# EAGLE design zik-pcb-power (EAGLE 6.4)
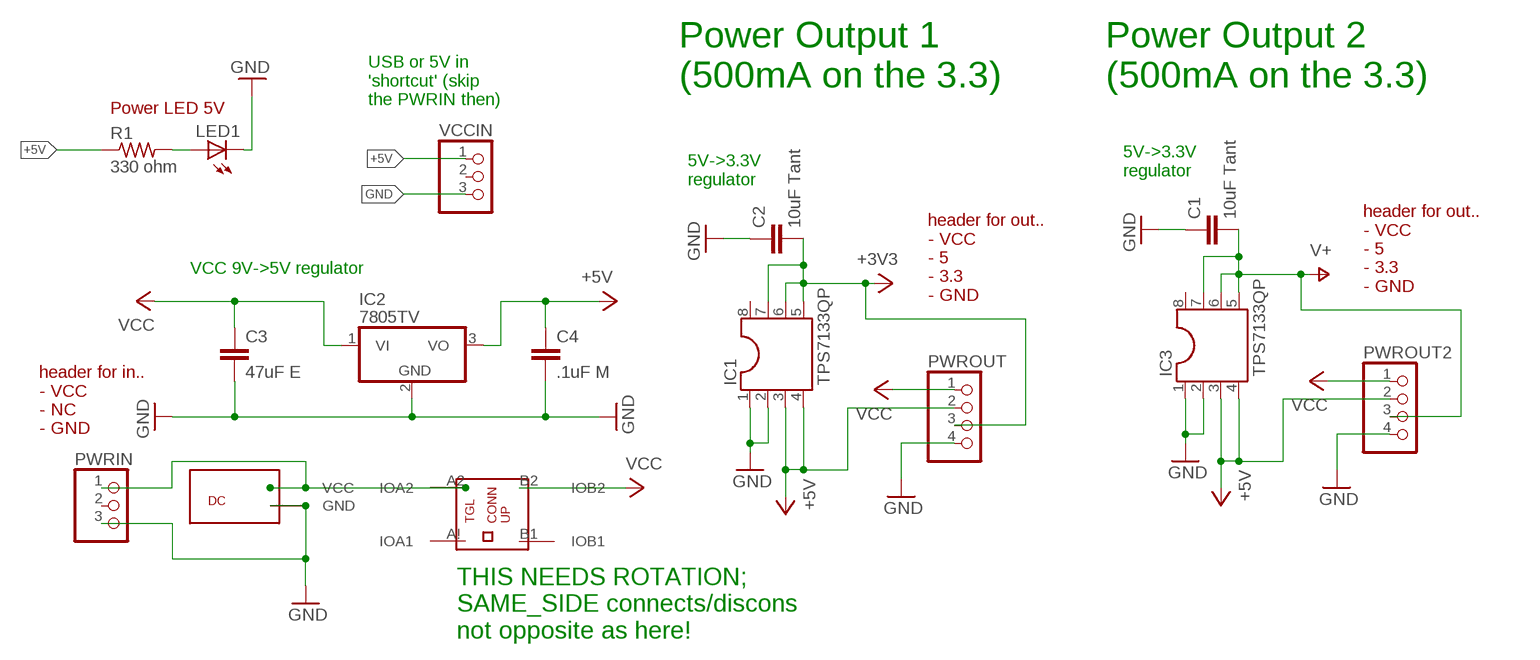
[diagram p0: schematic, sheet 1]

## Parts
C1  10uF Tant  C-EU025-025X050  [C025-025X050]
C2  10uF Tant  C-EU025-025X050  [C025-025X050]
C3  47uF E  C-EU025-025X050  [C025-025X050]
C4  .1uF M  C-EU025-025X050  [C025-025X050]
IC1  TPS7133QP  DIL8  [DIL08]
IC2  7805TV  [TO220V]
IC3  TPS7133QP  DIL8  [DIL08]
LED1  LED5MM  [LED5MM]
PWRIN  PINHD-1X3  [1X03]
PWROUT  PINHD-1X4  [1X04]
PWROUT2  PINHD-1X4  [1X04]
R1  330 ohm  R-US_0207/10  [0207/10]
U$1  DCJACKZIK  [DCJACKZIK]
U$2  TOGGLE-CYAN-L-ZIK  [TOGGLE-CYAN-LG-ZIK]
VCCIN  PINHD-1X3  [1X03]

## Nets
+3V3: C2.2 IC1.5 IC1.6 IC1.7 PWROUT.3
+5V: C4.1 IC1.3 IC1.4 IC2.3(VO) IC3.3 IC3.4 PWROUT2.2 PWROUT.2 R1.1 VCCIN.1
GND: C1.1 C2.1 C3.2 C4.2 IC1.1 IC1.2 IC2.2(GND) IC3.1 IC3.2 LED1.K(C) PWRIN.3 PWROUT2.4 PWROUT.4 U$1.JACKET(GND) VCCIN.3
N$1: PWRIN.1 U$1.CPIN(VCC) U$2.A2(IOA2)
N$3: LED1.A R1.2
V+: C1.2 IC3.5 IC3.6 IC3.7 PWROUT2.3
VCC: C3.1 IC2.1(VI) PWROUT2.1 PWROUT.1 U$2.B2(IOB2)
Unconnected: IC1.8 IC3.8 PWRIN.2 U$2.A!(IOA1) U$2.B1(IOB1) VCCIN.2

## Notes on the sheet
- Power Output 1
  (500mA on the 3.3)
- Power Output 2
  (500mA on the 3.3)
- USB or 5V in
  'shortcut' (skip
  the PWRIN then)
- Power LED 5V
- 5V->3.3V
  regulator
- 5V->3.3V
  regulator
- VCC 9V->5V regulator
- header for out..
  - VCC
  - 5
  - 3.3
  - GND
- header for out..
  - VCC
  - 5
  - 3.3
  - GND
- header for in..
  - VCC
  - NC
  - GND
- THIS NEEDS ROTATION;
  SAME_SIDE connects/discons
  not opposite as here!

## Library data of the parts
C1-C4 = rcl:C-EU: CAPACITOR, European symbol
IC1 IC3 = ic-package:DIL8: Dual In Line / Socket
IC2 = linear:78*: Positive VOLTAGE REGULATOR Source: http://cache.national.com/ds/LM/LM78L05.pdf http://www.fairchildsemi.com/ds/LM/LM7805.pdf
LED1 = SparkFun-LED:LED: LEDs Standard schematic elements and footprints for 5mm, 3mm, 1206, and 0603 sized LEDs. 5mm - Spark Fun Electronics SKU : COM-00529 (and others)
PWRIN VCCIN = pinhead:PINHD-1X3: PIN HEADER
PWROUT PWROUT2 = pinhead:PINHD-1X4: PIN HEADER
R1 = rcl:R-US_: RESISTOR, American symbol
U$1 = skeezix:DCJACKZIK
U$2 = skeezix:TOGGLE-CYAN-L-ZIK

## Board
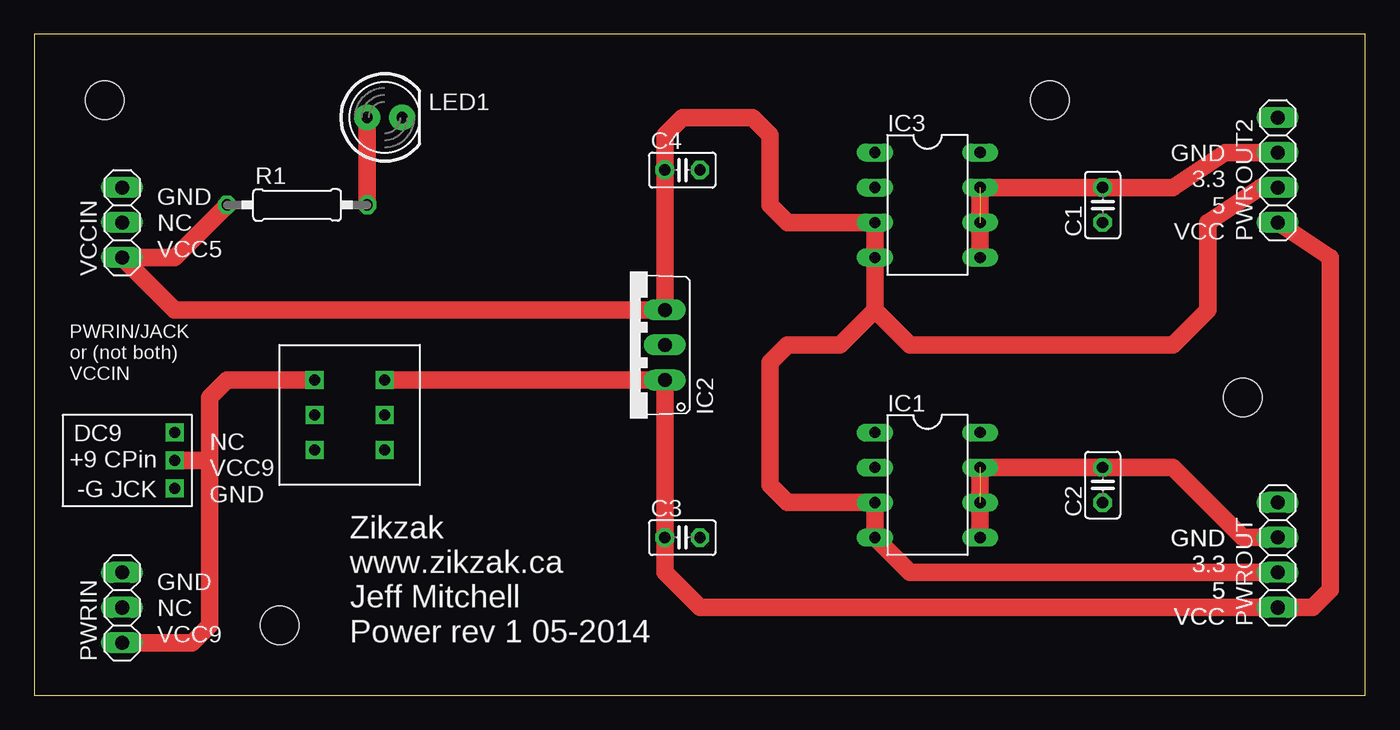
[diagram p1: board, top side]
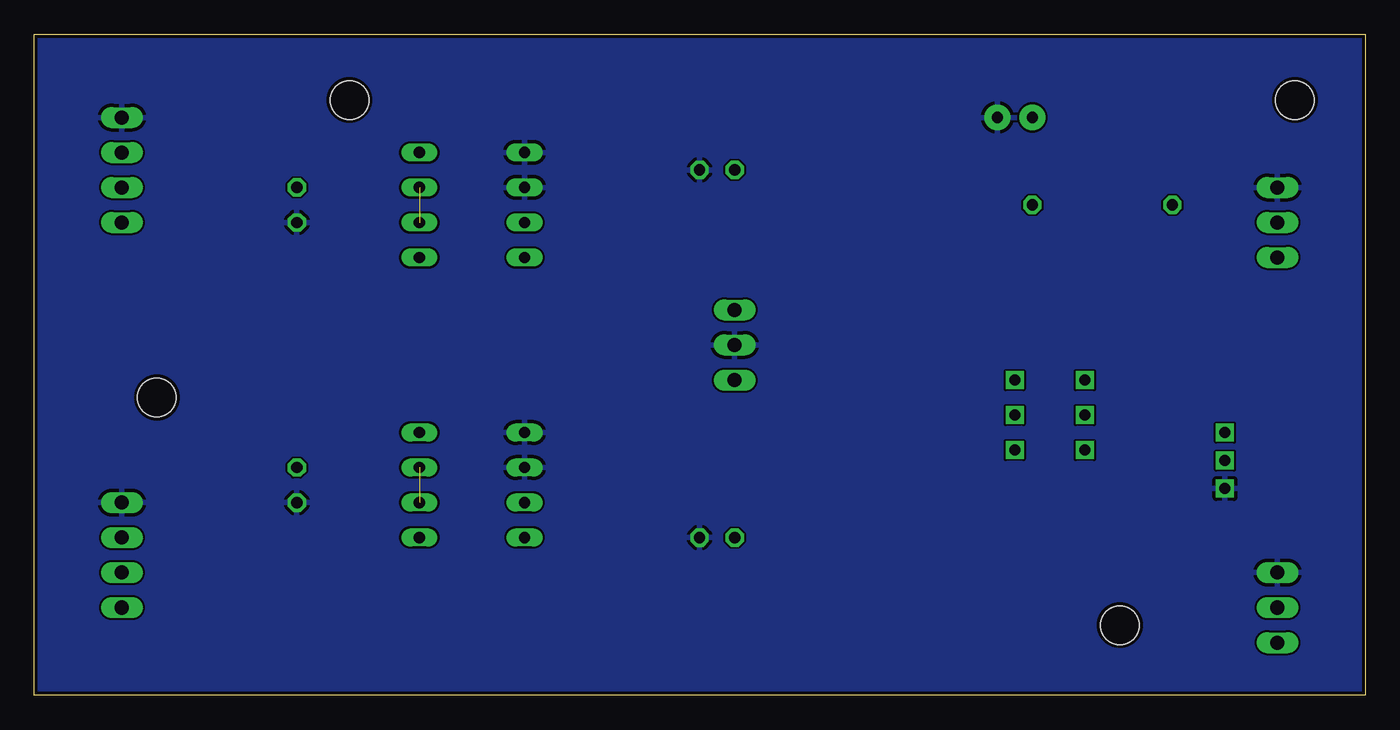
[diagram p2: board, bottom side, seen from below]

Size 96.5 x 47.93 mm. Coordinates in mm from the lower left corner, seen from the top.
Outline: 0,0 96.5,0 96.5,47.93 0,47.93 0,0
Copper layers (1*16): Top 0.035mm / dielectric 1.5mm / Bottom 0.035mm
Design rules "Elecrow_2-layer_eagle_rule": minimum track width 6mil, minimum drill 12mil, track to track 6mil, track to pad 6mil, pad to pad 6mil, via to via 6mil, smd to smd 0mil, copper to edge 10mil, drill to drill 10mil, minimum pad ring 10mil, minimum via ring 6mil, stop-mask expansion 2mil, vias tented up to drill 100mil, thermal gap 10mil
Holes 2.8 mm at 5.08,43.18 87.63,21.59 73.66,43.18 17.78,5.08

### Footprints (pad centres in the part's own frame; a part is rotated, then mirrored left to right if it is on the bottom)
C025-025X050 = drill 0.813 octagon: 1 -1.27,0; 2 1.27,0
DIL08 = drill 0.813 long: 1 -3.81,-3.81; 2 -1.27,-3.81; 3 1.27,-3.81; 4 3.81,-3.81; 5 3.81,3.81; 6 1.27,3.81; 7 -1.27,3.81; 8 -3.81,3.81
TO220V = drill 1.016 long: 1 -2.54,-2.54; 2 0,-2.54; 3 2.54,-2.54
LED5MM = drill 0.813 pad 1.88: A -1.27,0; K 1.27,0
1X03 = drill 1.016 long: 1 -2.54,0; 2 0,0; 3 2.54,0
1X04 = drill 1.016 long: 1 -3.81,0; 2 -1.27,0; 3 1.27,0; 4 3.81,0
0207/10 = drill 0.813 octagon: 1 -5.08,0; 2 5.08,0
DCJACKZIK = drill 0.8 square: CPIN 1.27,3.302; JACKET 1.27,5.334; UNUSED 1.27,1.27
TOGGLE-CYAN-LG-ZIK = drill 0.8 square: A2 7.62,7.62; A! 2.54,7.62; B1 2.54,2.54; B2 7.62,2.54; NA1 5.08,7.62; NA2 5.08,2.54

### Placement (x,y rotation side)
C1  77.47,35.56 90 top
C2  77.47,15.24 90 top
C3  46.99,11.43 0 top
C4  46.99,38.1 0 top
IC1  64.77,15.24 270 top
IC2  43.18,25.4 90 top
IC3  64.77,35.56 270 top
LED1  25.4,41.91 0 top
PWRIN  6.35,6.35 90 top
PWROUT  90.17,10.16 90 top
PWROUT2  90.17,38.1 90 top
R1  19.05,35.56 0 top
U$1  11.43,20.32 180 top
U$2  27.94,15.24 90 top
VCCIN  6.35,34.29 90 top

### Tracks (layer width: path | path; a pad name or v marks a point on that pad's centre or on a via)
+3V3  (1 unrouted)
  Top 1.27: IC1.5 IC1.7 C2.2 82.55,16.51 87.63,11.43 PWROUT.3 88.9,11.43
+5V
  Top 1.27: R1.1 10.16,31.75 VCCIN.1 10.16,27.94 IC2.3 C4.1 45.72,40.64 46.99,41.91 52.07,41.91 53.34,40.64 53.34,35.56 54.61,34.29 IC3.3 | IC3.3 IC3.4 | PWROUT2.2 88.9,36.83 85.09,34.29 85.09,27.94 82.55,25.4 63.5,25.4 60.96,27.94 | PWROUT.2 63.5,8.89 IC1.4 IC1.3 54.61,13.97 53.34,15.24 53.34,24.13 54.61,25.4 58.42,25.4 60.96,27.94 | IC3.3 60.96,27.94
GND
  pour Bottom: 0,48.26 0,0 96.52,0 96.52,48.26
N$1
  Top 1.27: U$2.A2 13.97,22.86 12.7,21.59 12.7,17.02 | 11.43,3.81 PWRIN.1 11.43,3.81 | 11.43,3.81 12.7,5.08 12.7,16.51 12.7,17.02 | U$1.CPIN 12.7,17.02
N$3
  Top 1.27: R1.2 LED1.A
V+  (1 unrouted)
  Top 1.27: IC3.5 IC3.7 C1.2 82.55,36.83 86.36,39.37 PWROUT2.3
VCC
  Top 1.27: U$2.B2 IC2.1 C3.1 45.72,8.89 48.26,6.35 PWROUT.1 92.71,6.35 93.98,7.62 93.98,31.75 PWROUT2.1

### Text on the board
tPlace: GND / 3.3 / 5 / VCC | GND / NC / VCC5 | PWRIN/JACK / or (not both) / VCCIN | NC / VCC9 / GND | GND / 3.3 / 5 / VCC | GND / 3.3 / 5 / VCC | GND / NC / VCC9 | Zikzak / www.zikzak.ca / Jeff Mitchell / Power rev 1 05-2014